# EAGLE design nanonode-xmega-mc-headers-qfp (EAGLE 5.10)
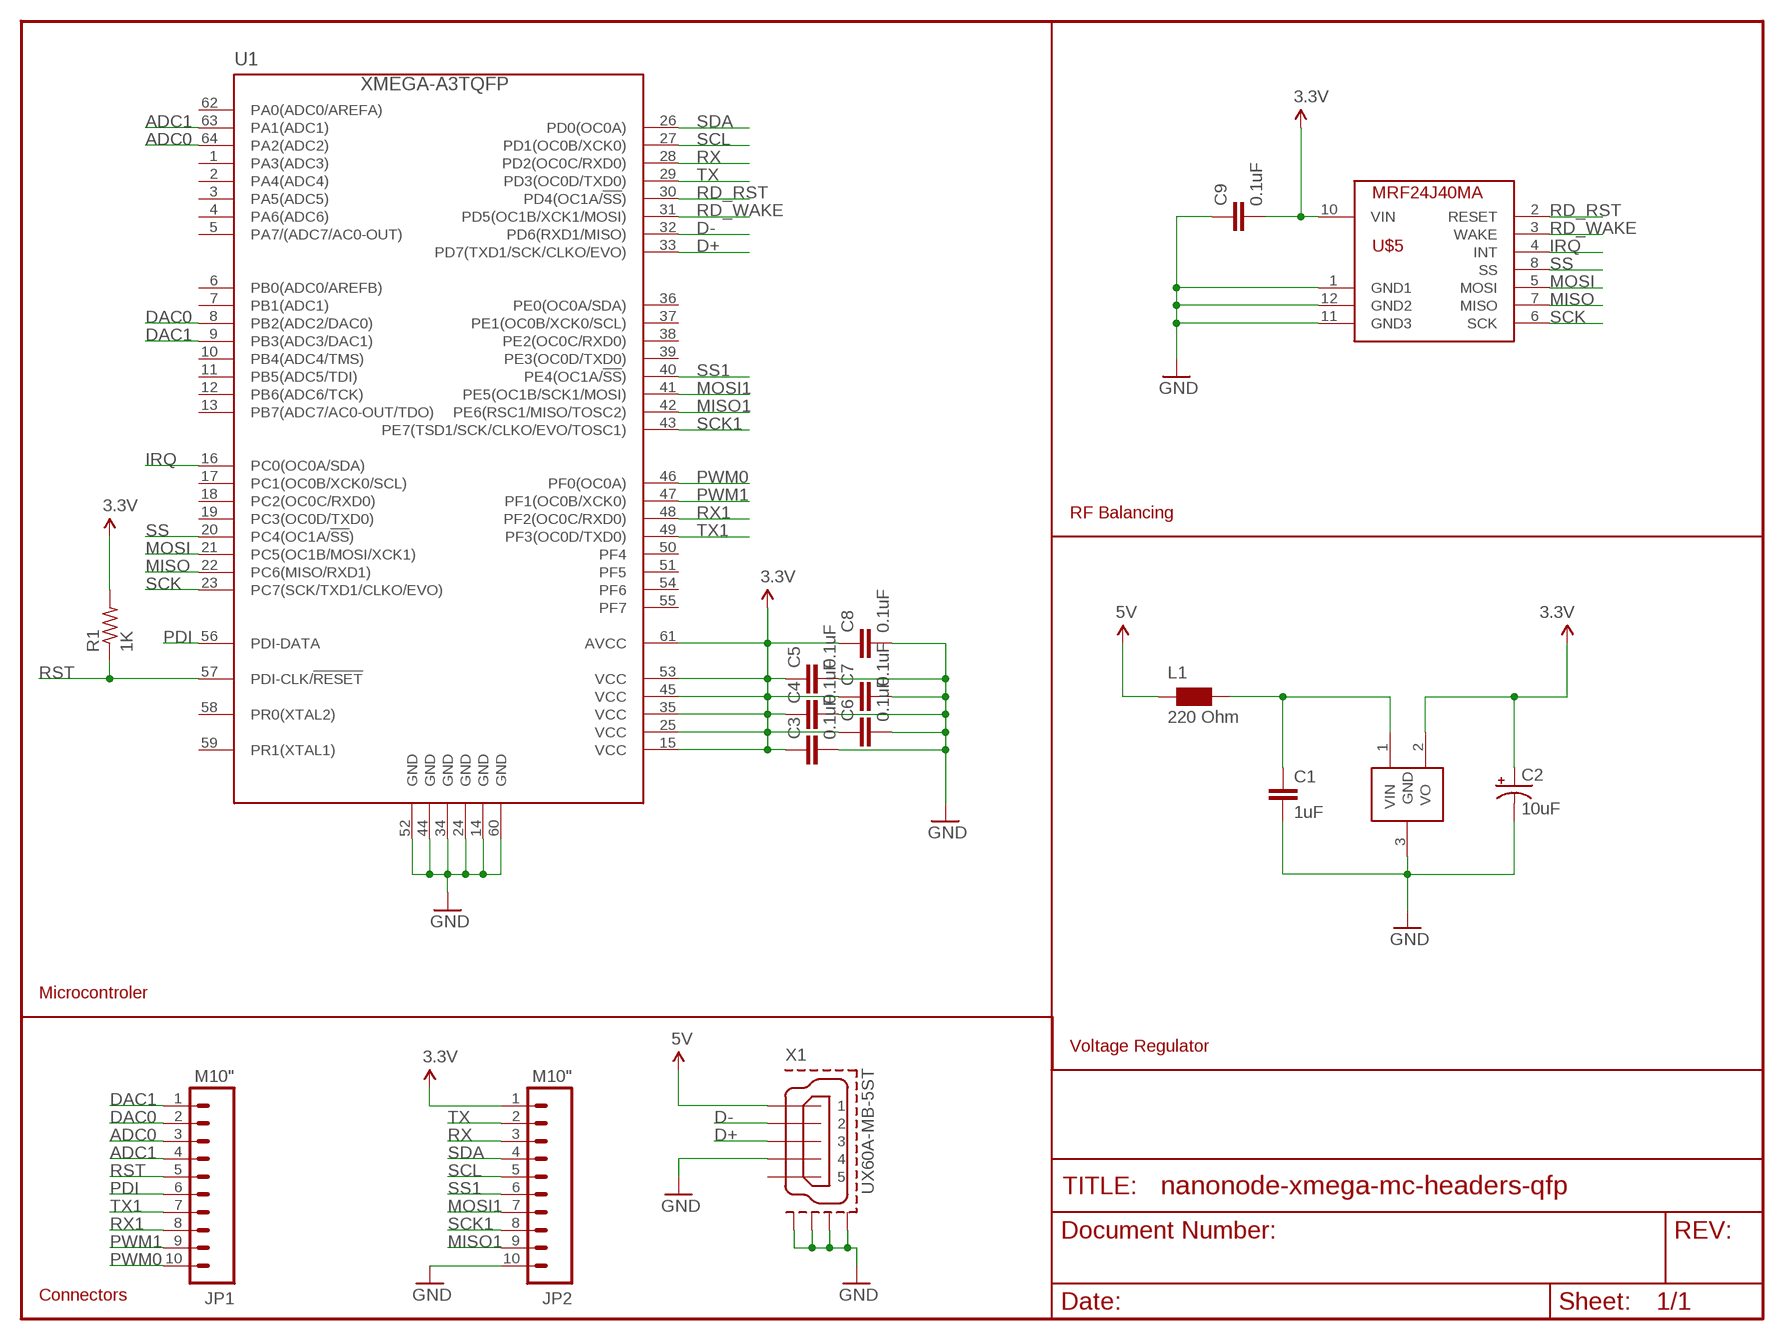
[diagram p0: schematic, sheet 1]

## Parts
C1  1uF  C-EUC0603  [C0603]
C2  10uF  CAP_POL1206  [EIA3216]
C3  0.1uF  C-EUC0603  [C0603]
C4  0.1uF  C-EUC0603  [C0603]
C5  0.1uF  C-EUC0603  [C0603]
C6  0.1uF  C-EUC0603  [C0603]
C7  0.1uF  C-EUC0603  [C0603]
C8  0.1uF  C-EUC0603  [C0603]
C9  0.1uF  C-EUC0603  [C0603]
JP1  M10"  [1X10]
JP2  M10"  [1X10]
L1  220 Ohm  WE-CBF_0603  [0603]
R1  1K  R-US_R0603  [R0603]
U1  XMEGA-A3TQFP  [TQFP64]
U2  MCP1700  [SOT23-3]
U$5  MRF24J40MA  [MRF24J40MA]
X1  UX60A-MB-5ST  MINI-USB-SHIELD-UX60A-MB-5ST  [UX60A-MB-5ST]

## Nets
3.3V: C2.A(+) C3.1 C4.1 C5.1 C6.1 C7.1 C8.1 C9.2 JP2.1 R1.2 U1.15(VCC) U1.25(VCC) U1.35(VCC) U1.45(VCC) U1.53(VCC) U1.61(AVCC) U2.2(VO) U$5.10(VIN)
5V: L1.1 X1.1
ADC0: JP1.3 U1.64(PA2(ADC2))
ADC1: JP1.4 U1.63(PA1(ADC1))
D+: U1.33(PD7(TXD1/SCK/CLKO/EVO)) X1.3
D-: U1.32(PD6(RXD1/MISO)) X1.2
DAC0: JP1.2 U1.8(PB2(ADC2/DAC0))
DAC1: JP1.1 U1.9(PB3(ADC3/DAC1))
GND: C1.2 C2.C(-) C3.2 C4.2 C5.2 C6.2 C7.2 C8.2 C9.1 JP2.10 U1.14(GND) U1.24(GND) U1.34(GND) U1.44(GND) U1.52(GND) U1.60(GND) U2.3(GND) U$5.1(GND1) U$5.11(GND3) U$5.12(GND2) X1.4 X1.M1(GND1) X1.M2(GND2) X1.M3(GND3) X1.M4(GND4)
IRQ: U1.16(PC0(OC0A/SDA)) U$5.4(INT)
MISO: U1.22(PC6(MISO/RXD1)) U$5.7(MISO)
MISO1: JP2.9 U1.42(PE6(RSC1/MISO/TOSC2))
MOSI: U1.21(PC5(OC1B/MOSI/XCK1)) U$5.5(MOSI)
MOSI1: JP2.7 U1.41(PE5(OC1B/SCK1/MOSI))
N$13: C1.1 L1.2 U2.1(VIN)
PDI: JP1.6 U1.56(PDI-DATA)
PWM0: JP1.10 U1.46(PF0(OC0A))
PWM1: JP1.9 U1.47(PF1(OC0B/XCK0))
RD_RST: U1.30(PD4(OC1A/!SS!)) U$5.2(RESET)
RD_WAKE: U1.31(PD5(OC1B/XCK1/MOSI)) U$5.3(WAKE)
RST: JP1.5 R1.1 U1.57(PDI-CLK/!RESET)
RX: JP2.3 U1.28(PD2(OC0C/RXD0))
RX1: JP1.8 U1.48(PF2(OC0C/RXD0))
SCK: U1.23(PC7(SCK/TXD1/CLKO/EVO)) U$5.6(SCK)
SCK1: JP2.8 U1.43(PE7(TSD1/SCK/CLKO/EVO/TOSC1))
SCL: JP2.5 U1.27(PD1(OC0B/XCK0))
SDA: JP2.4 U1.26(PD0(OC0A))
SS: U1.20(PC4(OC1A/!SS!)) U$5.8(SS)
SS1: JP2.6 U1.40(PE4(OC1A/!SS!))
TX: JP2.2 U1.29(PD3(OC0D/TXD0))
TX1: JP1.7 U1.49(PF3(OC0D/TXD0))
Unconnected: U1.1(PA3(ADC3)) U1.2(PA4(ADC4)) U1.3(PA5(ADC5)) U1.4(PA6(ADC6)) U1.5(PA7/(ADC7/AC0-OUT)) U1.6(PB0(ADC0/AREFB)) U1.7(PB1(ADC1)) U1.10(PB4(ADC4/TMS)) U1.11(PB5(ADC5/TDI)) U1.12(PB6(ADC6/TCK)) U1.13(PB7(ADC7/AC0-OUT/TDO)) U1.17(PC1(OC0B/XCK0/SCL)) U1.18(PC2(OC0C/RXD0)) U1.19(PC3(OC0D/TXD0)) U1.36(PE0(OC0A/SDA)) U1.37(PE1(OC0B/XCK0/SCL)) U1.38(PE2(OC0C/RXD0)) U1.39(PE3(OC0D/TXD0)) U1.50(PF4) U1.51(PF5) U1.54(PF6) U1.55(PF7) U1.58(PR0(XTAL2)) U1.59(PR1(XTAL1)) U1.62(PA0(ADC0/AREFA)) X1.5

## Notes on the sheet
- RF Balancing
- Microcontroler
- Voltage Regulator
- Connectors

## Library data of the parts
C1 C3-C9 = rcl:C-EU: CAPACITOR, European symbol
C2 = sparkfun:CAP_POL: Capacitor Polarized These are standard SMD and PTH capacitors. Normally 10uF, 47uF, and 100uF in electrolytic and tantalum varieties. Always verify the external diameter of the through hole cap, it varies with capacity, voltage, and manufacturer. The EIA devices should be standard.
JP1 JP2 = sparkfun:M10: Header 10 Standard 10-pin 0.1" header. Use with straight break away headers (SKU : PRT-00116), right angle break away headers (PRT-00553), swiss pins (PRT-00743), machine pins (PRT-00117), and female headers (PRT-00115).
L1 = wuerth-elektronik:WE-CBF: SMD EMI Suppression Ferrite Beads - excellent anti-EMI properties - low DCR - impedances till 3000 ohms - rated current up to 6 A
R1 = rcl:R-US_: RESISTOR, American symbol
U1 = custom:XMEGA-A3: Atmel XMega A3 series processor
U2 = nonolith:MCP1700: Voltage regulator
U$5 = custom:MRF24J40MA
X1 = usb_con-update:MINI-USB-SHIELD-: MINI USB Connector Source: http://www.hirose.co.jp/cataloge_hp/e24000019.pdf

## Board
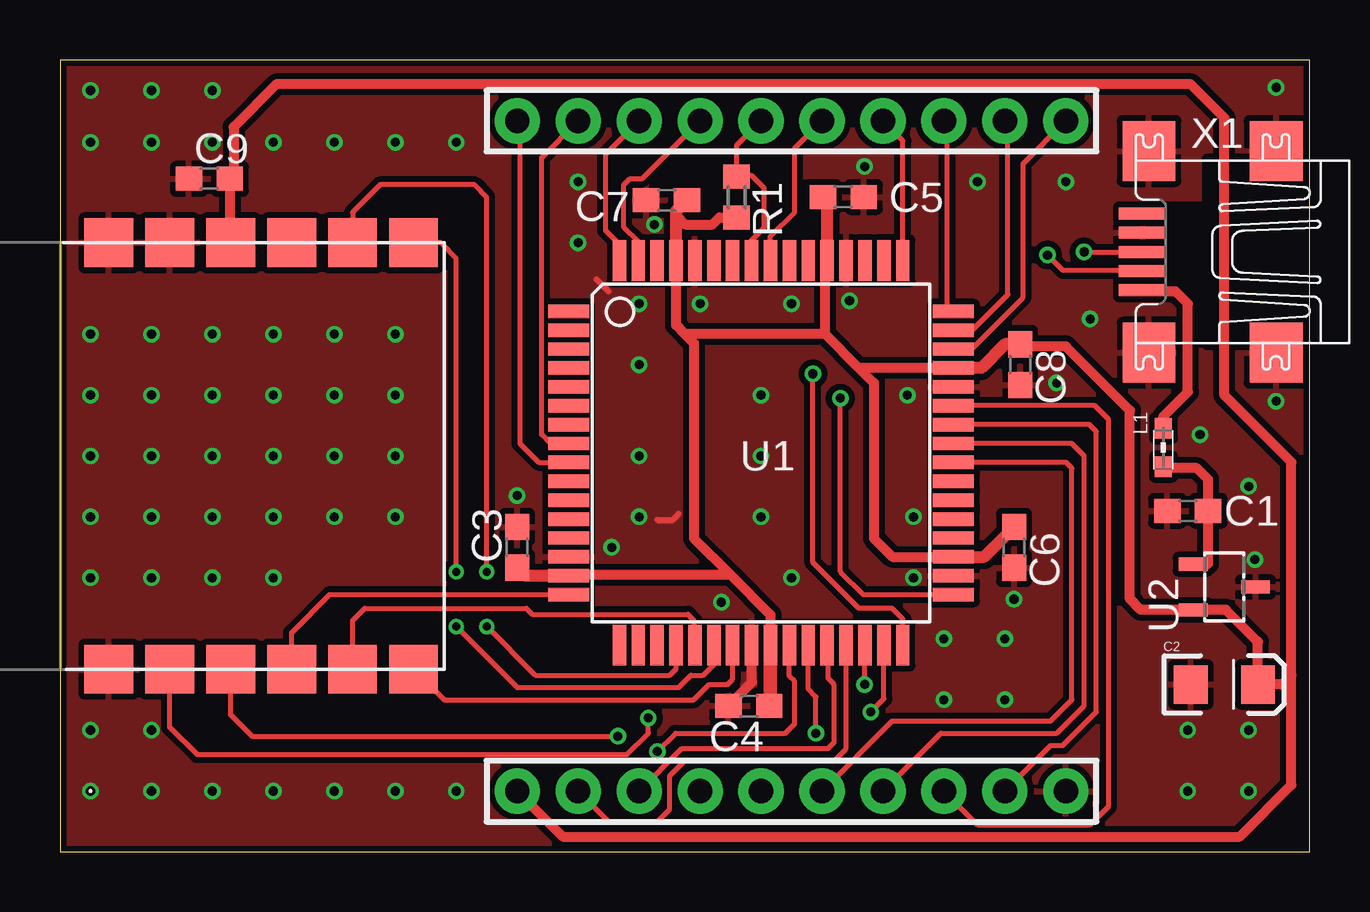
[diagram p1: board, top side]
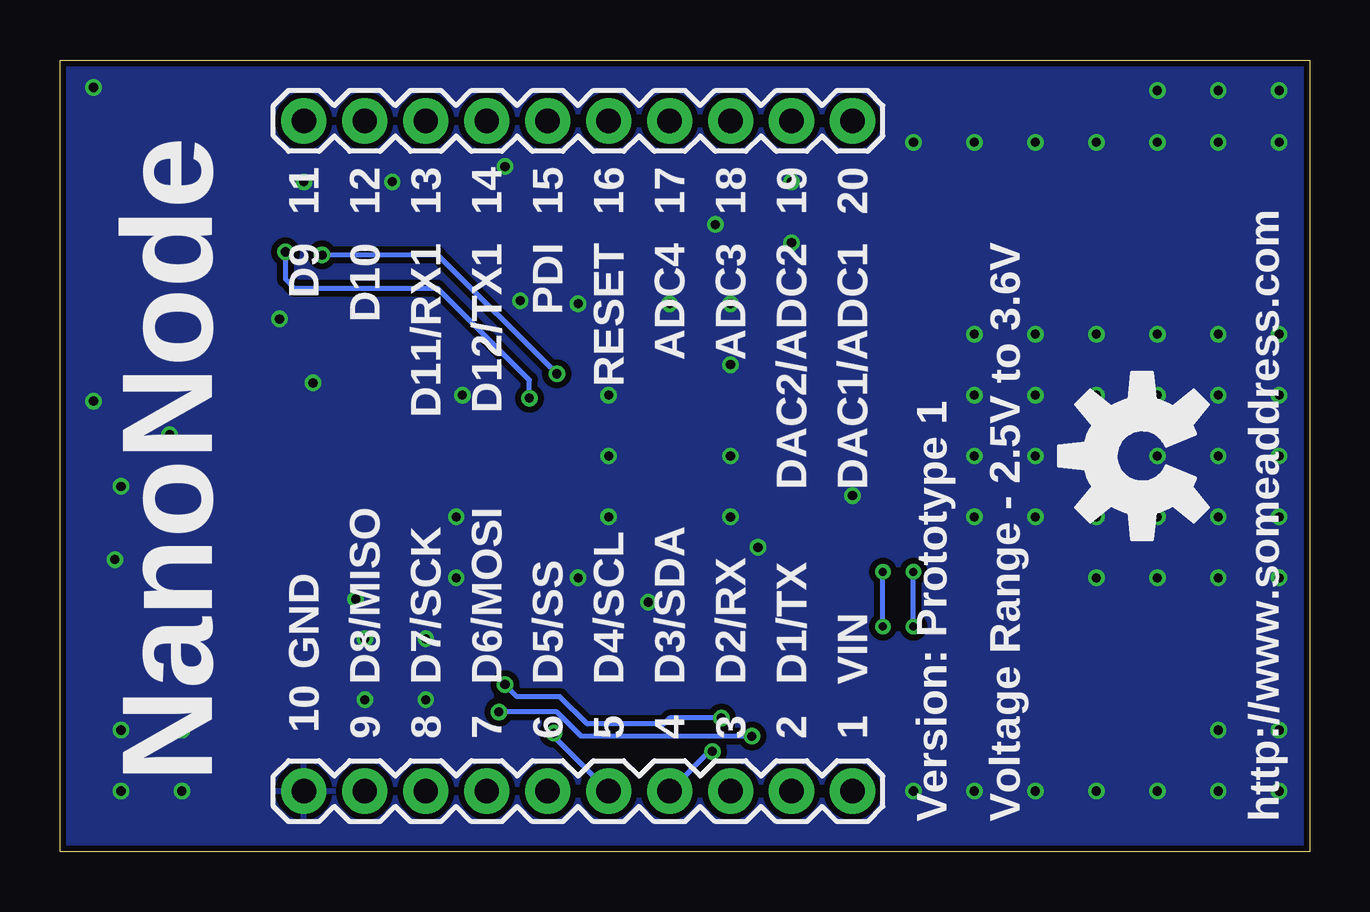
[diagram p2: board, bottom side, seen from below]

Size 52.07 x 33.02 mm. Coordinates in mm from the lower left corner, seen from the top.
Outline: 52.07,33.02 0,33.02 0,0 52.07,0 52.07,33.02
Copper layers (1*16): Top 0.035mm / dielectric 1.5mm / Bottom 0.035mm
Design rules "Fusion_eagle_rule_v1.1": minimum track width 6mil, minimum drill 12mil, track to track 6mil, track to pad 6mil, pad to pad 6mil, via to via 6mil, smd to smd 0mil, copper to edge 10mil, drill to drill 10mil, minimum pad ring 10mil, minimum via ring 6mil, stop-mask expansion 2mil, vias tented up to drill 100mil, thermal gap 10mil

### Footprints (pad centres in the part's own frame; a part is rotated, then mirrored left to right if it is on the bottom)
C0603 = smd 1.1 x 1: 1 -0.85,0; 2 0.85,0
EIA3216 = smd 1.4 x 1.6: A 1.4,0; C -1.4,0
1X10 = drill 1.016 pad 1.88 round: 1 0,0; 2 2.54,0; 3 5.08,0; 4 7.62,0; 5 10.16,0; 6 12.7,0; 7 15.24,0; 8 17.78,0; 9 20.32,0; 10 22.86,0
0603 = smd 0.85 x 0.7: 1 -0.9,0; 2 0.7,0
R0603 = smd 1 x 1.1: 1 -0.85,0; 2 0.85,0
TQFP64 = smd 1.702 x 0.559: 1 -8.014,5.905; 2 -8.014,5.118; 3 -8.014,4.331; 4 -8.014,3.543; 5 -8.014,2.756; 6 -8.014,1.968; 7 -8.014,1.181; 8 -8.014,0.394; 9 -8.014,-0.394; 10 -8.014,-1.181; 11 -8.014,-1.968; 12 -8.014,-2.756; 13 -8.014,-3.543; 14 -8.014,-4.331; 15 -8.014,-5.118; 16 -8.014,-5.905; 33 8.014,-5.905; 34 8.014,-5.118; 35 8.014,-4.331; 36 8.014,-3.543; 37 8.014,-2.756; 38 8.014,-1.968; 39 8.014,-1.181; 40 8.014,-0.394; 41 8.014,0.394; 42 8.014,1.181; 43 8.014,1.968; 44 8.014,2.756; 45 8.014,3.543; 46 8.014,4.331; 47 8.014,5.118; 48 8.014,5.905 | smd 0.559 x 1.702: 17 -5.905,-8.014; 18 -5.118,-8.014; 19 -4.331,-8.014; 20 -3.543,-8.014; 21 -2.756,-8.014; 22 -1.968,-8.014; 23 -1.181,-8.014; 24 -0.394,-8.014; 25 0.394,-8.014; 26 1.181,-8.014; 27 1.968,-8.014; 28 2.756,-8.014; 29 3.543,-8.014; 30 4.331,-8.014; 31 5.118,-8.014; 32 5.905,-8.014; 49 5.905,8.014; 50 5.118,8.014; 51 4.331,8.014; 52 3.543,8.014; 53 2.756,8.014; 54 1.968,8.014; 55 1.181,8.014; 56 0.394,8.014; 57 -0.394,8.014; 58 -1.181,8.014; 59 -1.968,8.014; 60 -2.756,8.014; 61 -3.543,8.014; 62 -4.331,8.014; 63 -5.118,8.014; 64 -5.905,8.014
SOT23-3 = smd 0.55 x 1.2: 1 0.95,1.3; 2 -0.95,1.3; 3 0,-1.3
MRF24J40MA = smd 2.032 x 2.032: 1 -13.97,0; 2 -11.43,0; 3 -8.89,0; 4 -6.35,0; 5 -3.81,0; 6 -1.27,0; 7 -1.27,17.78; 8 -3.81,17.78; 9 -6.35,17.78; 10 -8.89,17.78; 11 -11.43,17.78; 12 -13.97,17.78
UX60A-MB-5ST = smd 2 x 0.5: 1 2.25,1.6; 2 2.25,0.8; 3 2.25,0; 4 2.25,-0.8; 5 2.25,-1.6 | smd 2.2 x 2.5: M1 -3.3,-4.2; M2 -3.3,4.2; M3 2,4.2; M4 2,-4.2

### Placement (x,y rotation side)
C1  46.99,14.22 180 top
C2  48.51,6.99 0 top
C3  19.05,12.7 90 top
C4  28.7,6.1 180 top
C5  32.64,27.3 0 top
C6  39.75,12.7 270 top
C7  25.27,27.18 180 top
C8  40.01,20.32 270 top
C9  6.22,28.07 0 top
JP1  19.05,30.48 180 bottom
JP2  19.05,2.54 180 bottom
L1  45.97,16.76 270 top
R1  28.19,27.3 270 top
U1  29.21,16.64 0 top
U2  48.51,11.05 90 top
U$1  [OSHW-LOGO-L]  6.99,16.51 90 bottom
U$5  16,7.62 0 top
X1  47.37,25.02 180 top

### Tracks (layer width: path | path; a pad name or v marks a point on that pad's centre or on a via)
3.3V
  Top 0.254: 7.07,25.44 U$5.10
  Top 0.406: 7.07,25.44 C9.2 7.2,28.19 7.24,28.19 7.24,30.23 9.02,32 47.12,32 48.51,30.61 48.51,19.05 51.31,16.26 51.31,7.37 | JP2.1 20.95,0.64 49.15,0.64 51.31,2.79 51.31,7.37 | U1.45 33.29,20.18 | 33.29,20.18 31.88,21.59 | 31.88,21.59 31.88,24.31 U1.53 | U1.35 34.68,12.31 33.91,13.08 33.91,19.56 33.29,20.18 | U1.25 29.6,9.89 27.94,11.56 | 27.94,11.56 21.49,11.56 U1.15 | 26.04,21.59 25.67,21.96 U1.61 25.67,25.13 | 31.88,21.59 26.04,21.59 | 26.04,21.59 26.42,21.21 26.42,13.08 27.94,11.56 | 19.38,11.52 C3.1 | C8.1 40.09,21.08 41.91,21.08 44.58,18.41 44.58,10.54 45.02,10.1 U2.2 48.58,10.1 49.91,8.76 C2.A 50.93,6.99 51.31,7.37 | R1.2 27.47,26.45 27.18,26.16 26.05,26.16 25.67,26.54
  Top 0.508: U1.45 38.38,20.18 39.37,21.17 C8.1 | U1.15 19.38,11.52 | U1.35 38.51,12.31 C6.1 | U1.61 25.65,24.66 | U1.53 31.97,27.13 C5.1 | 25.91,26.96 C7.1 25.67,26.72 25.67,26.54 25.67,25.13
  Top 0.559: U1.25 29.6,6.4 C4.1
5V
  Top 0.406: L1.1 45.97,18.16 46.99,19.18 46.99,22.86 46.48,23.37 45.17,23.37 X1.1
ADC0
  Top 0.203: U1.64 23.3,25.34 22.73,25.91 22.73,29.08 JP1.3
ADC1
  Top 0.203: U1.63 24.09,25.44 23.5,26.04 23.5,27.81 23.75,28.07 24.26,28.07 JP1.4
D+  (via drill 0.38)
  Top 0.203: U1.33 33.47,10.73 32.51,11.68 v32.51,18.92 | v42.67,25.02 X1.3
  Bottom 0.203: v32.51,18.92 32.51,19.68 36.32,23.5 42.29,23.5 42.67,23.88 v42.67,25.02
D-  (via drill 0.38)
  Top 0.203: U1.32 35.12,9.72 34.67,10.16 33.27,10.16 31.37,12.06 v31.37,19.94 | v41.15,24.89 41.78,24.26 45.08,24.26 X1.2
  Bottom 0.203: v31.37,19.94 36.32,24.89 v41.15,24.89
DAC0
  Top 0.203: U1.8 20.43,17.03 20.07,17.4 20.07,28.96 JP1.2
DAC1
  Top 0.203: U1.9 19.95,16.24 19.18,17.02 19.18,30.35 JP1.1
GND  (via drill 0.38)
  Top 0.254: 22.35,23.88 22.86,23.37 | 24.89,13.84 25.53,13.84 25.78,14.1
  Top 0.406: U1.24 28.83,8.87 28.83,7.07 C4.2
  other vias: 1.27,29.59 3.81,29.59 6.35,29.59 8.89,29.59 11.43,29.59 13.97,29.59 1.27,21.59 3.81,21.59 6.35,21.59 8.89,21.59 11.43,21.59 13.97,21.59 13.97,19.05 11.43,19.05 8.89,19.05 6.35,19.05 3.81,19.05 1.27,19.05 1.27,16.51 3.81,16.51 6.35,16.51 8.89,16.51 11.43,16.51 13.97,16.51 11.43,13.97 8.89,13.97 6.35,13.97 3.81,13.97 1.27,13.97 1.27,11.43 3.81,11.43 6.35,11.43 8.89,11.43 16.51,29.59 32.89,22.99 24.77,26.16 22.99,12.7 27.56,10.41 35.56,11.43 35.31,19.05 41.53,19.56 39.75,10.54 19.05,14.86 33.53,28.57 46.99,5.08 49.78,12.19 47.5,17.4 1.27,31.75 3.81,31.75 6.35,31.75 1.27,5.08 3.81,5.08 1.27,2.54 3.81,2.54 6.35,2.54 8.89,2.54 11.43,2.54 13.97,2.54 16.51,2.54 21.59,27.94 21.59,25.4 24.13,22.86 24.13,20.32 24.13,16.51 24.13,13.97 26.67,22.86 30.48,22.86 29.21,19.05 29.21,16.51 29.21,13.97 30.48,11.43 35.56,13.97 36.83,8.89 39.37,8.89 39.37,6.35 36.83,6.35 49.53,5.08 49.53,2.54 46.99,2.54 41.91,27.94 13.97,13.97 42.93,22.23 50.67,18.8 50.67,31.88 49.53,15.24 38.23,27.94
  pour Top (isolate 0.254): 52.07,33.02 0,33.02 0,0 52.07,0
  pour Bottom (isolate 0.254): 52.07,33.02 0,33.02 0,0 52.07,0
IRQ
  Top 0.203: U1.16 11.24,10.73 9.65,9.14 U$5.4
MISO  (via drill 0.33)
  Top 0.203: v16.51,11.68 16.51,24.77 15.88,25.4 U$5.7 | v16.51,9.4 19.05,6.86 25.78,6.86 26.29,7.37 26.8,7.37 27.24,7.81 U1.22
  Bottom 0.203: v16.51,9.4 v16.51,11.68
MISO1
  Top 0.203: U1.42 42.89,17.82 43.18,17.53 43.18,5.84 41.78,4.45 41.27,4.45 JP2.9
MOSI
  Top 0.203: U$5.5 12.19,9.65 12.7,10.16 19.43,10.16 19.68,9.91 26.16,9.91 26.42,9.65 26.42,8.91 U1.21
MOSI1
  Top 0.203: U1.41 42.15,17.03 42.67,16.51 42.67,6.1 41.53,4.95 36.7,4.95 JP2.7
N$1
  Top 0.005: 1.29,2.49 arc10 1.3,2.5 | 1.31,2.51 arc19 1.32,2.53 | 1.32,2.55 arc19 1.31,2.57 | 1.3,2.58 arc19 1.28,2.59 | 1.24,2.58 arc-19 1.26,2.59 | 1.22,2.55 arc-19 1.23,2.57 | 1.23,2.51 arc-19 1.22,2.53 | 1.25,2.49 arc-10 1.24,2.5 | 1.25,2.54 arc68 1.26,2.52 | 1.28,2.52 arc248 1.25,2.54 | 1.29,2.49 arc10 1.3,2.5 | 1.3,2.5 1.32,2.48 1.33,2.49 1.31,2.51 | 1.31,2.51 arc19 1.32,2.53 | 1.32,2.53 1.35,2.53 1.35,2.55 1.32,2.55 | 1.32,2.55 arc19 1.31,2.57 | 1.31,2.57 1.33,2.59 1.32,2.6 1.3,2.58 | 1.3,2.58 arc19 1.28,2.59 | 1.28,2.59 1.28,2.62 1.26,2.62 1.26,2.59 | 1.24,2.58 arc-19 1.26,2.59 | 1.24,2.58 1.22,2.6 1.21,2.59 1.23,2.57 | 1.22,2.55 arc-19 1.23,2.57 | 1.22,2.55 1.19,2.55 1.19,2.53 1.22,2.53 | 1.23,2.51 arc-19 1.22,2.53 | 1.23,2.51 1.21,2.49 1.22,2.48 1.24,2.5 | 1.25,2.49 arc-10 1.24,2.5 | 1.26,2.52 1.25,2.49 | 1.25,2.54 arc68 1.26,2.52 | 1.28,2.52 arc248 1.25,2.54 | 1.28,2.52 1.29,2.49
N$13
  Top 0.406: U2.1 47.81,12 47.84,12.03 C1.1 47.84,15.53 47.37,16 46.04,16 L1.2
PDI
  Top 0.203: U1.56 29.6,25.67 30.61,26.67 30.61,29.34 JP1.6
PWM0
  Top 0.203: U1.46 37.99,20.97 40.13,23.11 40.13,28.7 JP1.10
PWM1
  Top 0.152: U1.47 37.5,21.75
  Top 0.203: JP1.9 39.5,30.35 39.5,23.24 38.01,21.75 37.5,21.75
RD_RST  (via drill 0.38)
  Top 0.203: U$5.2 4.57,5.21 5.71,4.06 23.62,4.06 24.51,4.95 v24.51,5.59 | v33.53,6.99 33.53,8.61 U1.30
  Bottom 0.203: v24.51,5.59 26.67,5.59 26.92,5.33 30.1,5.33 31.24,6.48 33.02,6.48 v33.53,6.99
RD_WAKE  (via drill 0.38)
  Top 0.203: U1.31 34.33,6.39 v33.78,5.84 | v23.24,4.83 8,4.83 7.11,5.71 U$5.3
  Bottom 0.203: v33.78,5.84 31.37,5.84 30.35,4.83 v23.24,4.83
RST
  Top 0.203: U1.57 28.82,25.51 29.34,26.04 29.34,27.69 28.83,28.19 28.23,28.19 | 28.23,28.19 R1.1 | 28.23,28.19 28.19,28.19 28.19,29.46 JP1.5
RX
  Top 0.203: JP2.3 25.91,4.32 32,4.32 32.26,4.57 32.26,6.99 32,7.24 32,8.59 U1.28
RX1
  Top 0.203: JP1.8 36.97,30.34 36.97,22.8 U1.48
SCK
  Top 0.203: 14.99,7.37 U$5.6 16,6.35 26.42,6.35 27.05,6.99 27.81,6.99 28.03,7.2 U1.23
SCK1
  Top 0.203: U1.43 43.12,18.61 43.69,18.03 43.69,1.91 42.93,1.14 38.23,1.14 JP2.8
SCL  (via drill 0.38)
  Top 0.203: U1.27 31.18,6.79 31.5,6.48 v31.5,4.95
  Bottom 0.203: v31.5,4.95 31.5,4.83 JP2.5
SDA  (via drill 0.38)
  Top 0.203: U1.26 30.39,7.33 30.61,7.11 30.61,5.33 30.23,4.95 25.65,4.95 v24.89,4.19
  Bottom 0.203: v24.89,4.19 25.02,4.19 JP2.4
SS  (via drill 0.33)
  Top 0.203: v17.78,11.68 17.78,27.3 17.27,27.81 13.34,27.81 12.19,26.67 U$5.8 | U1.20 25.67,7.63 25.4,7.37 19.81,7.37 v17.78,9.4
  Bottom 0.203: v17.78,9.4 v17.78,11.68
SS1
  Top 0.203: U1.40 41.92,16.24 42.16,16 42.16,6.35 41.27,5.46 34.67,5.46 JP2.6
TX
  Top 0.203: U1.29 32.75,4.3 32.26,3.81 26.04,3.81 25.4,3.17 25.4,1.78 24.89,1.27 22.86,1.27 JP2.2
TX1
  Top 0.203: U1.49 35.12,29.65 JP1.7

### Text on the board
bPlace: 20 | 19 | 18 | 17 | 16 | 15 | 14 | 13 | 12 | 11 | DAC1/ADC1 | DAC2/ADC2 | ADC3 | ADC4 | RESET | PDI | D12/TX1 | D11/RX1 | D10 | D9 | GND | VIN | D1/TX | D2/RX | D3/SDA | D4/SCL | D5/SS | D6/MOSI | D7/SCK | D8/MISO | 10 | 1 | 2 | 3 | 4 | 5 | 6 | 7 | 8 | 9 | NanoNode | http://www.someaddress.com | Voltage Range - 2.5V to 3.6V | Version: Prototype 1